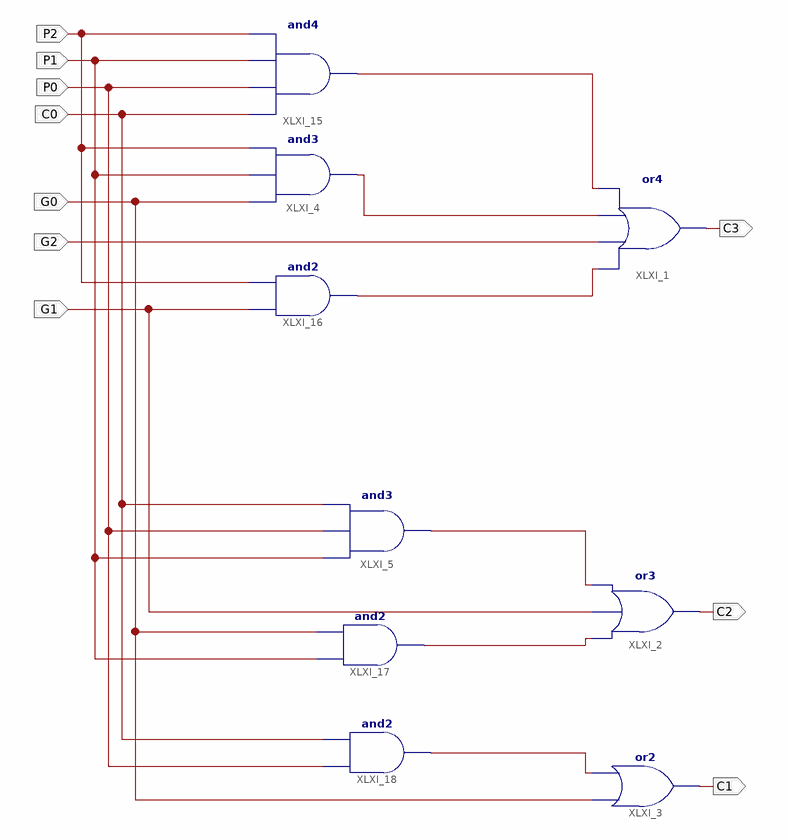
[diagram p0: schematic sheet 1]
// Xilinx ISE schematic CLA3Bit.sch (spartan3e) as structural Verilog: 9 symbols, 10 ports
module CLA3Bit (
  input  P2,
  input  P1,
  input  P0,
  input  C0,
  input  G0,
  input  G1,
  input  G2,
  output C3,
  output C2,
  output C1
);

  wire XLXN_1, XLXN_2, XLXN_7, XLXN_8, XLXN_9, XLXN_10;

  or XLXI_1 (C3, XLXN_8, G2, XLXN_1, XLXN_7);
  and XLXI_4 (XLXN_1, G0, P1, P2);
  or XLXI_2 (C2, XLXN_9, G1, XLXN_2);
  or XLXI_3 (C1, G0, XLXN_10);
  and XLXI_5 (XLXN_2, P1, P0, C0);
  and XLXI_15 (XLXN_7, C0, P0, P1, P2);
  and XLXI_16 (XLXN_8, G1, P2);
  and XLXI_17 (XLXN_9, P1, G0);
  and XLXI_18 (XLXN_10, P0, C0);
endmodule
